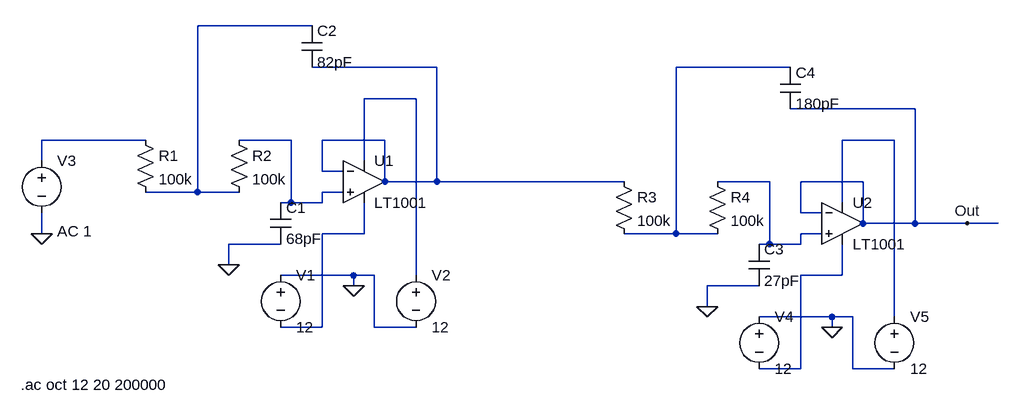
[diagram p0: schematic switching_filter.asc]
switching_filter.asc, the LTspice schematic file:
Version 4
SHEET 1 1140 680
WIRE 80 -80 -96 -80
WIRE 272 -16 80 -16
WIRE 816 -16 640 -16
WIRE 240 32 160 32
WIRE 1008 48 816 48
WIRE -176 96 -336 96
WIRE 48 96 -32 96
WIRE 192 96 96 96
WIRE 976 96 896 96
WIRE -336 128 -336 96
WIRE 160 128 160 32
WIRE 96 144 96 96
WIRE 128 144 96 144
WIRE 192 160 192 96
WIRE 272 160 272 -16
WIRE 272 160 192 160
WIRE 560 160 272 160
WIRE 784 160 704 160
WIRE 928 160 832 160
WIRE -96 176 -96 -80
WIRE -96 176 -176 176
WIRE -32 176 -96 176
WIRE 128 176 96 176
WIRE 48 192 48 96
WIRE 48 192 32 192
WIRE 96 192 96 176
WIRE 96 192 48 192
WIRE 896 192 896 96
WIRE 832 208 832 160
WIRE 864 208 832 208
WIRE 928 224 928 160
WIRE 1008 224 1008 48
WIRE 1008 224 928 224
WIRE 1088 224 1008 224
WIRE 1136 224 1088 224
WIRE -336 240 -336 208
WIRE 160 240 160 192
WIRE 160 240 96 240
WIRE 640 240 640 -16
WIRE 640 240 560 240
WIRE 704 240 640 240
WIRE 864 240 832 240
WIRE 32 256 -48 256
WIRE 784 256 784 160
WIRE 784 256 768 256
WIRE 832 256 832 240
WIRE 832 256 784 256
WIRE -48 288 -48 256
WIRE 144 304 32 304
WIRE 176 304 144 304
WIRE 240 304 240 32
WIRE 896 304 896 256
WIRE 896 304 832 304
WIRE 144 320 144 304
WIRE 768 320 688 320
WIRE 688 352 688 320
WIRE 880 368 768 368
WIRE 912 368 880 368
WIRE 976 368 976 96
WIRE 96 384 96 240
WIRE 96 384 32 384
WIRE 176 384 176 304
WIRE 240 384 176 384
WIRE 880 384 880 368
WIRE 832 448 832 304
WIRE 832 448 768 448
WIRE 912 448 912 368
WIRE 976 448 912 448
FLAG 144 320 0
FLAG -336 240 0
FLAG -48 288 0
FLAG 880 384 0
FLAG 688 352 0
FLAG 1088 224 Out
SYMBOL Opamps\\LT1001 160 96 R0
SYMATTR InstName U1
SYMBOL voltage 32 288 R0
WINDOW 123 0 0 Left 2
WINDOW 39 0 0 Left 2
SYMATTR InstName V1
SYMATTR Value 12
SYMBOL voltage 240 288 R0
WINDOW 123 0 0 Left 2
WINDOW 39 0 0 Left 2
SYMATTR InstName V2
SYMATTR Value 12
SYMBOL res -192 80 R0
SYMATTR InstName R1
SYMATTR Value 100k
SYMBOL res -48 80 R0
SYMATTR InstName R2
SYMATTR Value 100k
SYMBOL cap 16 192 R0
SYMATTR InstName C1
SYMATTR Value 68pF
SYMBOL cap 64 -80 R0
SYMATTR InstName C2
SYMATTR Value 82pF
SYMBOL Opamps\\LT1001 896 160 R0
SYMATTR InstName U2
SYMBOL voltage 768 352 R0
WINDOW 123 0 0 Left 2
WINDOW 39 0 0 Left 2
SYMATTR InstName V4
SYMATTR Value 12
SYMBOL voltage 976 352 R0
WINDOW 123 0 0 Left 2
WINDOW 39 0 0 Left 2
SYMATTR InstName V5
SYMATTR Value 12
SYMBOL res 544 144 R0
SYMATTR InstName R3
SYMATTR Value 100k
SYMBOL res 688 144 R0
SYMATTR InstName R4
SYMATTR Value 100k
SYMBOL cap 752 256 R0
SYMATTR InstName C3
SYMATTR Value 27pF
SYMBOL cap 800 -16 R0
SYMATTR InstName C4
SYMATTR Value 180pF
SYMBOL voltage -336 112 R0
WINDOW 123 24 124 Left 2
WINDOW 39 0 0 Left 2
SYMATTR Value2 AC 1
SYMATTR InstName V3
SYMATTR Value ""
TEXT -368 472 Left 2 !.ac oct 12 20 200000

The netlist it stands for:
* switching_filter.asc
XU1 N006 N002 N004 N009 N002 LT1001  ; pins In+ In- V+ V- OUT
V1 0 N009 12
V2 N004 0 12
R1 N005 N001 100k
R2 N006 N001 100k
C1 N006 0 68pF
C2 N001 N002 82pF
XU2 N008 Out N007 N010 Out LT1001  ; pins In+ In- V+ V- OUT
V4 0 N010 12
V5 N007 0 12
R3 N002 N003 100k
R4 N008 N003 100k
C3 N008 0 27pF
C4 N003 Out 180pF
V3 N005 0 AC 1
.ac oct 12 20 200000
.lib LTC.lib
.backanno
.end